# EAGLE schematic CW_KEY_EXTENSION (EAGLE 9.6.2)
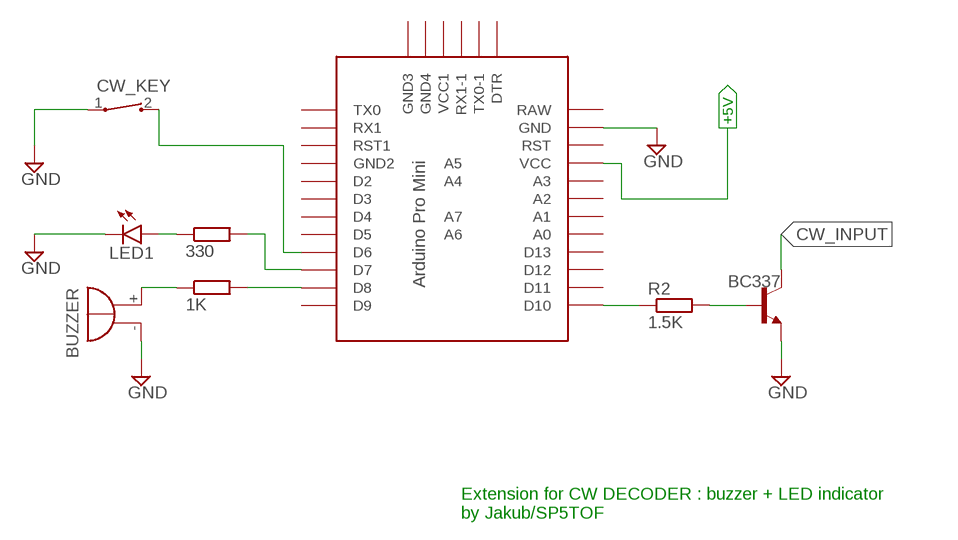
[diagram p0: schematic, sheet 1]

## Parts
BUZZER  EB2209A  [EB2209A]
CW_KEY  CT10-XXXX-A2  [CT10-XXXX-A2]
LED1  LAP4-BOTTOM  [P47F-BOTTOM]
R1  330  R-EU_0204/5  [0204/5]
R2  1.5K  R-EU_0204/5  [0204/5]
R3  1K  R-EU_0204/5  [0204/5]
T1  BC337  [TO92]
U$1  PRO-MINI-2  [PRO-MINI-2]

## Nets
+5V: U$1.VCC
CW_INPUT: T1.3(C)
GND: BUZZER.- CW_KEY.1 LED1.C T1.1(E) U$1.GND
N$1: R3.2 U$1.D8
N$2: BUZZER.+ R3.1
N$3: R1.2 U$1.D7
N$4: LED1.A R1.1
N$5: R2.1 U$1.D10
N$6: R2.2 T1.2(B)
N$8: CW_KEY.2 U$1.D6
Unconnected: U$1.A0 U$1.A1 U$1.A2 U$1.A3 U$1.A4 U$1.A5 U$1.A6 U$1.A7 U$1.D2 U$1.D3 U$1.D4 U$1.D5 U$1.D9 U$1.D11 U$1.D12 U$1.D13 U$1.DTR U$1.GND1(GND2) U$1.GND2(GND3) U$1.GND3(GND4) U$1.RAW U$1.RST U$1.RST1 U$1.RX1 U$1.RX1-1 U$1.TX0 U$1.TX0-1 U$1.VCC1

## Notes on the sheet
- Extension for CW DECODER : buzzer + LED indicator
  by Jakub/SP5TOF

## Library data of the parts
BUZZER = buzzer:EB2209A: BUZZER Source: Buerklin; OC_FARNELL: unknown; OC_NEWARK: unknown
CW_KEY = switch-coto:CT10-XXXX-: CT10 Series Molded Switch Source: www.cotorelay.com .. Coto_Technology__CT10-1530-G1.pdf
LED1 = led:*P4: PointLED® Enhanced Thinfilm LED TOP & BOTTOM mount LS P47F, LR P47F, LA P47F, LY P47F, LT P4SG, LB P4SG, LW P4SG Source: http://catalog.osram-os.com .. LA_LR_LS_LY_P47F_Pb_free.pdf
R1-R3 = rcl:R-EU_: RESISTOR, European symbol; SPICEPREFIX: R
T1 = transistor:BC337: NPN TRANSISTOR
U$1 = Arduino-clone:PRO-MINI-2: Arduino Pro Mini Layout 2 Sparkfun.com